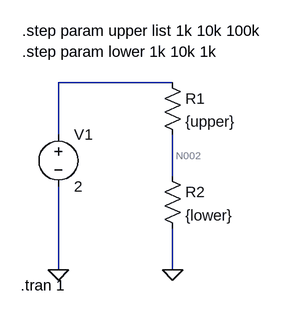
[diagram p0: schematic Draft1.asc]
Draft1.asc, the LTspice schematic file:
Version 4
SHEET 1 880 680
WIRE 192 48 16 48
WIRE 16 128 16 48
WIRE 192 192 192 128
WIRE 16 336 16 208
WIRE 192 336 192 272
FLAG 16 336 0
FLAG 192 336 0
SYMBOL voltage 16 112 R0
WINDOW 123 0 0 Left 0
WINDOW 39 0 0 Left 0
SYMATTR InstName V1
SYMATTR Value 2
SYMBOL res 176 32 R0
SYMATTR InstName R1
SYMATTR Value {upper}
SYMBOL res 176 176 R0
SYMATTR InstName R2
SYMATTR Value {lower}
TEXT -40 -32 Left 2 !.step param upper list 1k 10k 100k
TEXT -40 0 Left 2 !.step param lower 1k 10k 1k
TEXT -42 360 Left 2 !.tran 1

The netlist it stands for:
* Draft1.asc
V1 N001 0 2
R1 N001 N002 {upper}
R2 N002 0 {lower}
.step param upper list 1k 10k 100k
.step param lower 1k 10k 1k
.tran 1
.backanno
.end

* Results of the author's LTspice run, read from the files saved beside the schematic
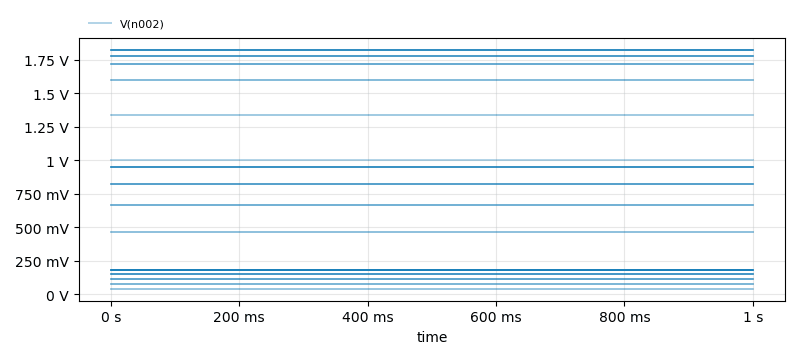
[diagram p1: Transient Analysis of Draft1.asc, plotted from the saved traces]
* Transient Analysis, 30 runs:
*   V(n002) [run 1]: min 1 V, max 1 V, average 1 V, rms 1 V, last 1 V
*   V(n002) [run 2]: min 181.8 mV, max 181.8 mV, average 181.8 mV, rms 181.8 mV, last 181.8 mV
*   V(n002) [run 3]: min 1.333 V, max 1.333 V, average 1.333 V, rms 1.333 V, last 1.333 V
*   V(n002) [run 4]: min 39.22 mV, max 39.22 mV, average 39.22 mV, rms 39.22 mV, last 39.22 mV
*   V(n002) [run 5]: min 461.5 mV, max 461.5 mV, average 461.5 mV, rms 461.5 mV, last 461.5 mV
*   V(n002) [run 6]: min 1.6 V, max 1.6 V, average 1.6 V, rms 1.6 V, last 1.6 V
*   V(n002) [run 7]: min 76.92 mV, max 76.92 mV, average 76.92 mV, rms 76.92 mV, last 76.92 mV
*   V(n002) [run 8]: min 666.7 mV, max 666.7 mV, average 666.7 mV, rms 666.7 mV, last 666.7 mV